# Altium schematic sheet Esquematico2.SchDoc
size A
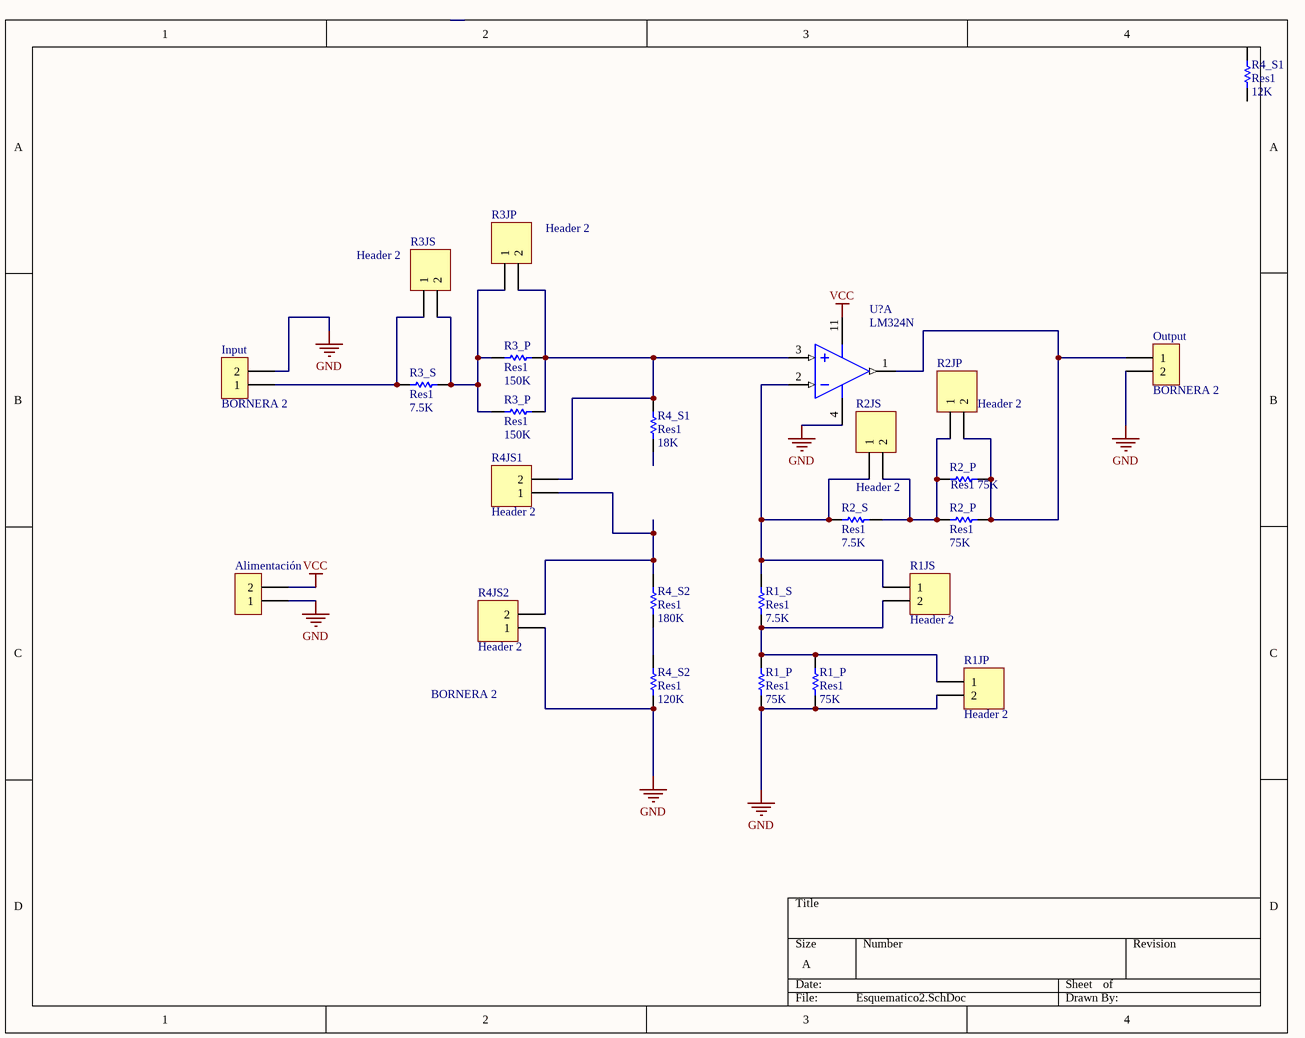
[diagram p0: Esquematico2.SchDoc]

## Parts
(Parts that share a designator on the sheet are numbered #1, #2 ... from top to bottom, then left to right.)
Alimentación  BORNERA 2  [BORNERA2]
Input  BORNERA 2  [BORNERA2]
Output  BORNERA 2  [BORNERA2]
R1_P#1  Res1  value 75K  [AXIAL-0.3]
R1_P#2  Res1  value 75K  [AXIAL-0.3]
R1_S  Res1  value 7.5K  [AXIAL-0.3]
R1JP  Header 2  [HDR1X2]
R1JS  Header 2  [HDR1X2]
R2_P#1  Res1  value 75K  [AXIAL-0.3]
R2_P#2  Res1  value 75K  [AXIAL-0.3]
R2_S  Res1  value 7.5K  [AXIAL-0.3]
R2JP  Header 2  [HDR1X2]
R2JS  Header 2  [HDR1X2]
R3_P#1  Res1  value 150K  [AXIAL-0.3]
R3_P#2  Res1  value 150K  [AXIAL-0.3]
R3_S  Res1  value 7.5K  [AXIAL-0.3]
R3JP  Header 2  [HDR1X2]
R3JS  Header 2  [HDR1X2]
R4_S1#1  Res1  value 12K  [AXIAL-0.3]
R4_S1#2  Res1  value 18K  [AXIAL-0.3]
R4_S2#1  Res1  value 180K  [AXIAL-0.3]
R4_S2#2  Res1  value 120K  [AXIAL-0.3]
R4JS1  Header 2  [HDR1X2]
R4JS2  Header 2  [HDR1X2]
U?  LM324N  [N14A]  (part A of 4)

## Nets
GND: Alimentación.1 Input.2 Output.2 R1_P#1.1 R1_P#2.1 R1JP.2 R4_S2#2.1 R4JS2.1 U?.4(V+)
VCC: Alimentación.2 U?.11(GND)
NetInput_1: Input.1 R3_S.1 R3JS.1
NetOutput_1: Output.1 R2_P#1.1 R2_P#2.1 R2JP.2 U?.1(OUT1)
NetR1_P#1_2: R1_P#1.2 R1_P#2.2 R1_S.1 R1JP.1 R1JS.2
NetR1_S_2: R1_S.2 R1JS.1 R2_S.2 R2JS.1 U?.2(IN1-)
NetR2_P#1_2: R2_P#1.2 R2_P#2.2 R2_S.1 R2JP.1 R2JS.2
NetR3_P#1_1: R3_P#1.1 R3_P#2.1 R3_S.2 R3JP.1 R3JS.2
NetR3_P#1_2: R3_P#1.2 R3_P#2.2 R3JP.2 R4_S1#2.2 R4JS1.2 U?.3(IN1+)
NetR4_S2#1_1: R4_S2#1.1 R4_S2#2.2
NetR4_S2#1_2: R4_S2#1.2 R4JS1.1 R4JS2.2

Not connected (* = marked no-connect by the designer): R4_S1#1 1 2; R4_S1#2 1

## Library data of the parts
R1_P#1 R1_P#2 R1_S R2_P#1 R2_P#2 R2_S R3_P#1 R3_P#2 R3_S R4_S1#1 R4_S1#2 R4_S2#1 R4_S2#2 = Res1: Resistor; Published: 8-Jun-2000; LatestRevisionDate: 17-Jul-2002; LatestRevisionNote: Re-released for DXP Platform.; PackageReference: AXIAL-0.3; Publisher: Altium Limited; PackageDescription: Axial Device, Thru-Hole; 2 Leads; 0.3 in Pin Spacing
R1JP R1JS R2JP R2JS R3JP R3JS R4JS1 R4JS2 = Header 2: Header, 2-Pin; LatestRevisionDate: 17-Jul-2002; LatestRevisionNote: Re-released for DXP Platform.; Publisher: Altium Limited
U? = LM324N: Low Power Quad Operational Amplifier, 14-pin MDIP; Manufacturer: National Semiconductor; PackageTopMarking: NSUZXYYTTE#*LM324N; PowerWise: N; CompType: Amplifiers; Published: 4-Dec-2008; LatestRevisionDate: 13-Jan-2009; LatestRevisionNote: Sim Model Added.; DatasheetVersion: Aug-2000; PackageVersion: revG, May-2006; PackageReference: N14A; Publisher: Altium Limited; PackageDescription: MDIP, .750 x .250 x.130in, 14 Lead, .100in Pitch; PartNumber: LM324N; RoHS: N; PinCount: 14; Code_JEDEC: MS-001-AA; ComponentLink1Description: LM324 Datasheet; ComponentLink1URL: http://www.national.com/ds/LM/LM324.pdf; ComponentLink2Description: LM324 Web Page; ComponentLink2URL: http://www.national.com/pf/LM/LM324.html; ComponentLink3Description: N14A Package Page; ComponentLink3URL: http://www.national.com/packaging/folders/n14a.html